# Altium schematic sheet POWER.SchDoc
size A4
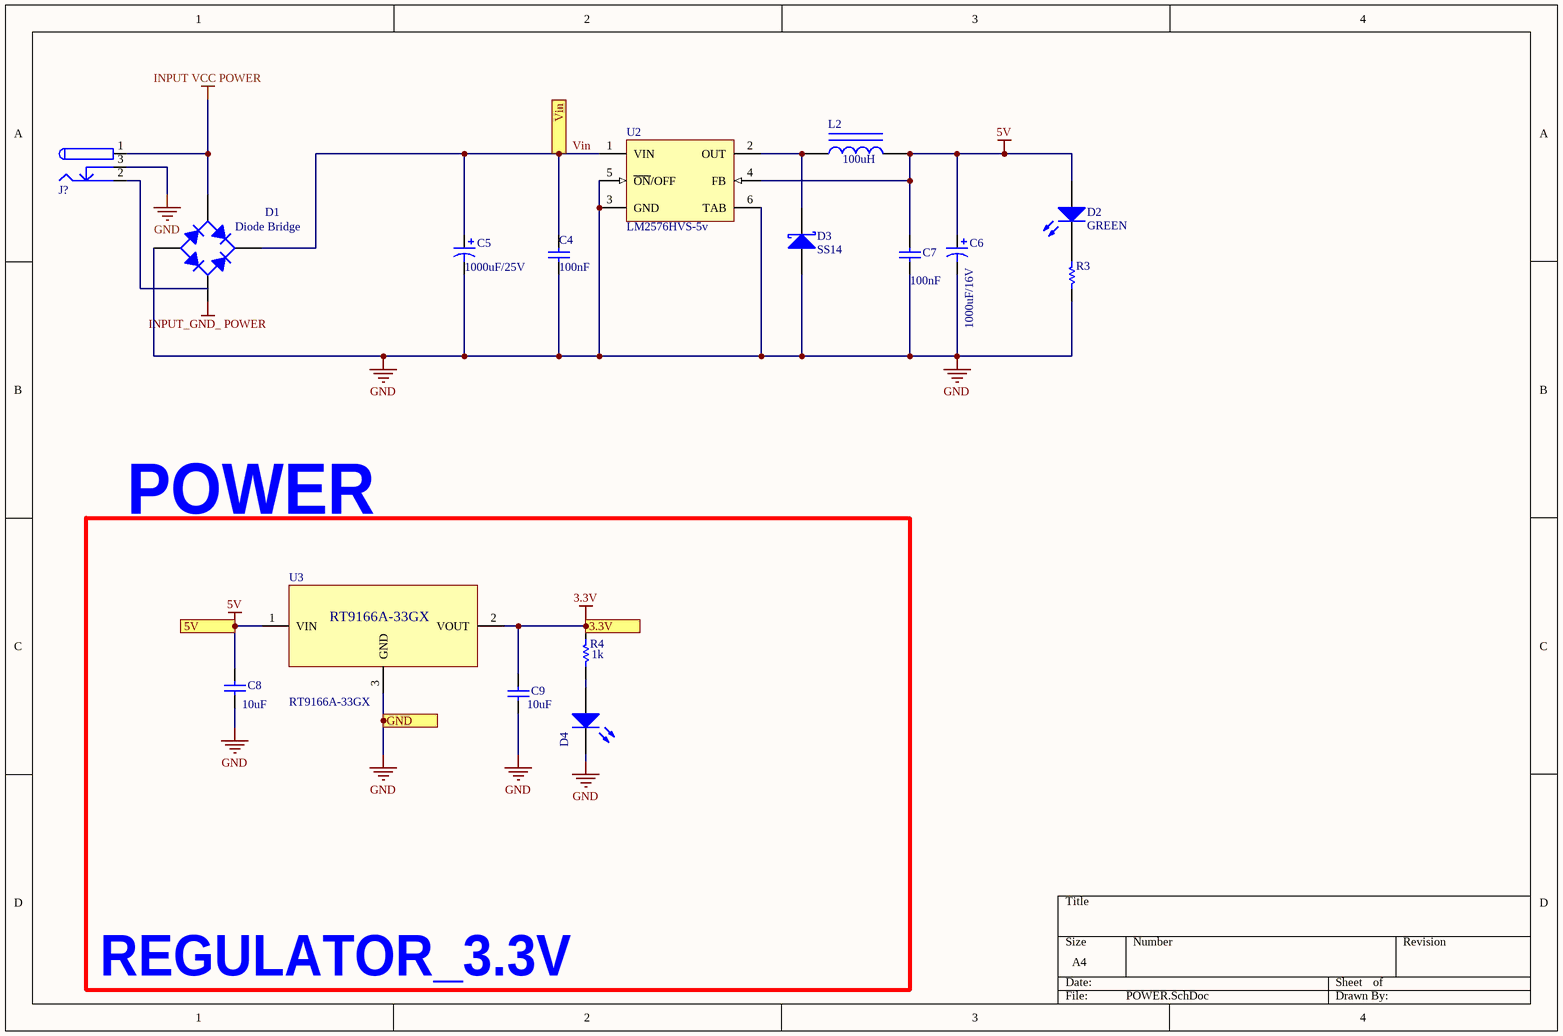
[diagram p0: POWER.SchDoc]

## Parts
C4  100nF  [0805 - CAP]
C5  1000uF/25V  [Rad.1/.2-SMALL 8*16 - duplicate]
C6  1000uF/16V  [Rad.1/.2-SMALL 8*16]
C7  100nF  [0805 - CAP]
C8  10uF  [0603 - RESISTOR]
C9  10uF  [0603 - RESISTOR]
D1  Diode Bridge  [Bridge]
D2  GREEN  [0805AK_green]
D3  SS14  [ss14 / sma]
D4  GREEN  [0603 -LED_GREEN - duplicate]  (value not drawn)
J?  DC Power Jack  [DC Power Jack 1]  (value not drawn)
L2  100uH  [IND_SMD12X12]
R3  330R  [0805/resistor]  (value not drawn)
R4  1k  [0603 - RESISTOR]
U2  LM2576HVS-5v  [lm2576/adj/TS5B_N]
U3  RT9166A-33GX  [SOT89 (RT9166)]

## Blocks framed on the sheet
POWER: C8 C9 D4 R4 U3

## Ports
3.3V, 5V, GND, Vin

## Nets
3.3V: C9.1 R4.1 U3.2(VOUT) ; port 3.3V
5V: C6.1 C7.2 C8.2 D2.1(A) L2.2 U2.4(FB) U3.1(VIN) ; port 5V
GND: C4.1 C5.2 C6.2 C7.1 C8.1 C9.2 D1.3(A) D3.1(A) D4.2(K) J?.3 R3.2 U2.3(GND) U2.5(~{ON}/OFF) U2.6(TAB) U3.3(GND) ; port GND
INPUT VCC POWER: D1.4(C) J?.1
INPUT_GND_ POWER: D1.2(C)
Vin: C4.2 C5.1 D1.1(K) U2.1(VIN) ; port Vin
NetD2_2: D2.2(K) R3.1
NetD3_2: D3.2(K) L2.1 U2.2(OUT)
NetD4_1: D4.1(A) R4.2

Not connected (* = marked no-connect by the designer): J? 2

## Notes on the sheet
- REGULATOR_3.3V

## Library data of the parts
C4 C7-C9 = Cap: Capacitor; Published: 8-Jun-2000; LatestRevisionDate: 17-Jul-2002; LatestRevisionNote: Re-released for DXP Platform.; PackageReference: RAD-0.3; Publisher: Altium Limited; PackageDescription: Radial Cap, Thru-Hole; 2 Leads; 0.3 in Pin Spacing
  C4 C7: Value: 100nF
  C8 C9: Value: 10uF
C5 C6 = Cap Pol1: Polarized Capacitor (Radial); Published: 8-Jun-2000; LatestRevisionDate: 17-Jul-2002; LatestRevisionNote: Re-released for DXP Platform.; PackageReference: RB7.6-15; Publisher: Altium Limited; PackageDescription: Polarized Capacitor (Radial); 2 Leads
  C5: Value: 1000uF/25V
  C6: Value: 1000uF/16V
D1 = Diode Bridge: Full Wave Diode Bridge; Company: E.P.I.L; Design Date: 2011/11/02
D2 = LED0: Typical INFRARED GaAs LED; Published: 8-Jun-2000; LatestRevisionDate: 08-Jul-2005; LatestRevisionNote: Mech Layer 1 removed.; PackageReference: LED-0; Publisher: Altium Limited; PackageDescription: LED; 2 Leads
D3 = Diode 1N5822: Silicon AF Schottky Diode for High-Speed Switching; Note: Pin 2 is not connected and not drawn.; Published: 21-Mar-2003; LatestRevisionDate: 29-May-2009; LatestRevisionNote: IPC-7351 Footprint Added.; DatasheetVersion: Oct-1999; PackageVersion: Sep-2001; PackageReference: SOT-23; Publisher: Altium Limited; PackageDescription: 3-Pin SOT-23 Package 0.95 mm Pitch, 2.5 mm Lead Span; ComponentLink1Description: Manufacturer Link; ComponentLink1URL: http://www.infineon.com/; ComponentLink2Description: Datasheet; ComponentLink2URL: http://www.infineon.com/upload/Document/cmc_upload/documents/009/382/bas40_bas140series_1.pdf
D4 = LED SMD
J? = DC Power Jack: DC Power Jack. Center Pin 2.5mm. Diameter: 5.7mm; Designer: Ali Hafizi; Company: Personal; Project Name: Laser; Adding Date: 10/21/2009
L2 = Inductor Iron: CD54-100MT-10UH; Published: 24-Mar-1999; LatestRevisionDate: 17-Jul-2002; LatestRevisionNote: Re-released for DXP Platform.; PackageReference: AXIAL-0.9; Publisher: Altium Limited; PackageDescription: Axial Device, Thru-Hole; 2 Leads; 0.9 in Pin Spacing; Value: 100uH
R3 R4 = Res1: Resistor; Published: 8-Jun-2000; LatestRevisionDate: 17-Jul-2002; LatestRevisionNote: Re-released for DXP Platform.; PackageReference: AXIAL-0.3; Publisher: Altium Limited; PackageDescription: Axial Device, Thru-Hole; 2 Leads; 0.3 in Pin Spacing
  R3: Value: 330R
  R4: Value: 1k
U2 = LM2576HVS-ADJ: SIMPLE SWITCHER® 3A Step-Down Voltage Regulator, 5-pin TO-263; Manufacturer: National Semiconductor; PackageTopMarking: NSUZXYTTE#*LM2576*HVS-ADJ P+; PowerWise: N; High-Reliability: Y; DatasheetVersion: Aug-2004; PackageVersion: revD, Apr-2005; PackageReference: TS5B; PackageDescription: TO-263, Molded, .400 x .390 x .180in, 5 Lead, .067in Pitch, Surface Mount; PartNumber: LM2576HVS-ADJ; RoHS: N; PinCount: 5; CompType: Switcher; Code_JEDEC: MO-169-AB; ComponentLink1Description: Manufacturer URL; ComponentLink1URL: http://www.national.com/; ComponentLink2Description: LM2576HV Datasheet; ComponentLink2URL: http://www.national.com/ds/LM/LM2576HV.pdf; ComponentLink3Description: LM2576HV Web Page; ComponentLink3URL: http://www.national.com/pf/LM/LM2576HV.html; ComponentLink4Description: TS5B Package Page; ComponentLink4URL: http://www.national.com/packaging/folders/ts5b.html
U3 = RT9166A-33GX: REGULATOR 3.3V; Manufacturer_Name: Vishay; Manufacturer_Part_Number: 2N7002; Datasheet Link: https://www.diodes.com/assets/Datasheets/ds11303.pdf; Height: 1.2mm; Mouser Part Number: 781-2N7002; Mouser Price/Stock: https://www.mouser.com/Search/Refine.aspx?Keyword=781-2N7002; RS Part Number: 2370907P; RS Price/Stock: http://uk.rs-online.com/web/p/products/2370907P